# Altium schematic sheet motherboard_mcu.SchDoc
size 840 x 594 mm; SheetNumber: 1; SheetTotal: 5
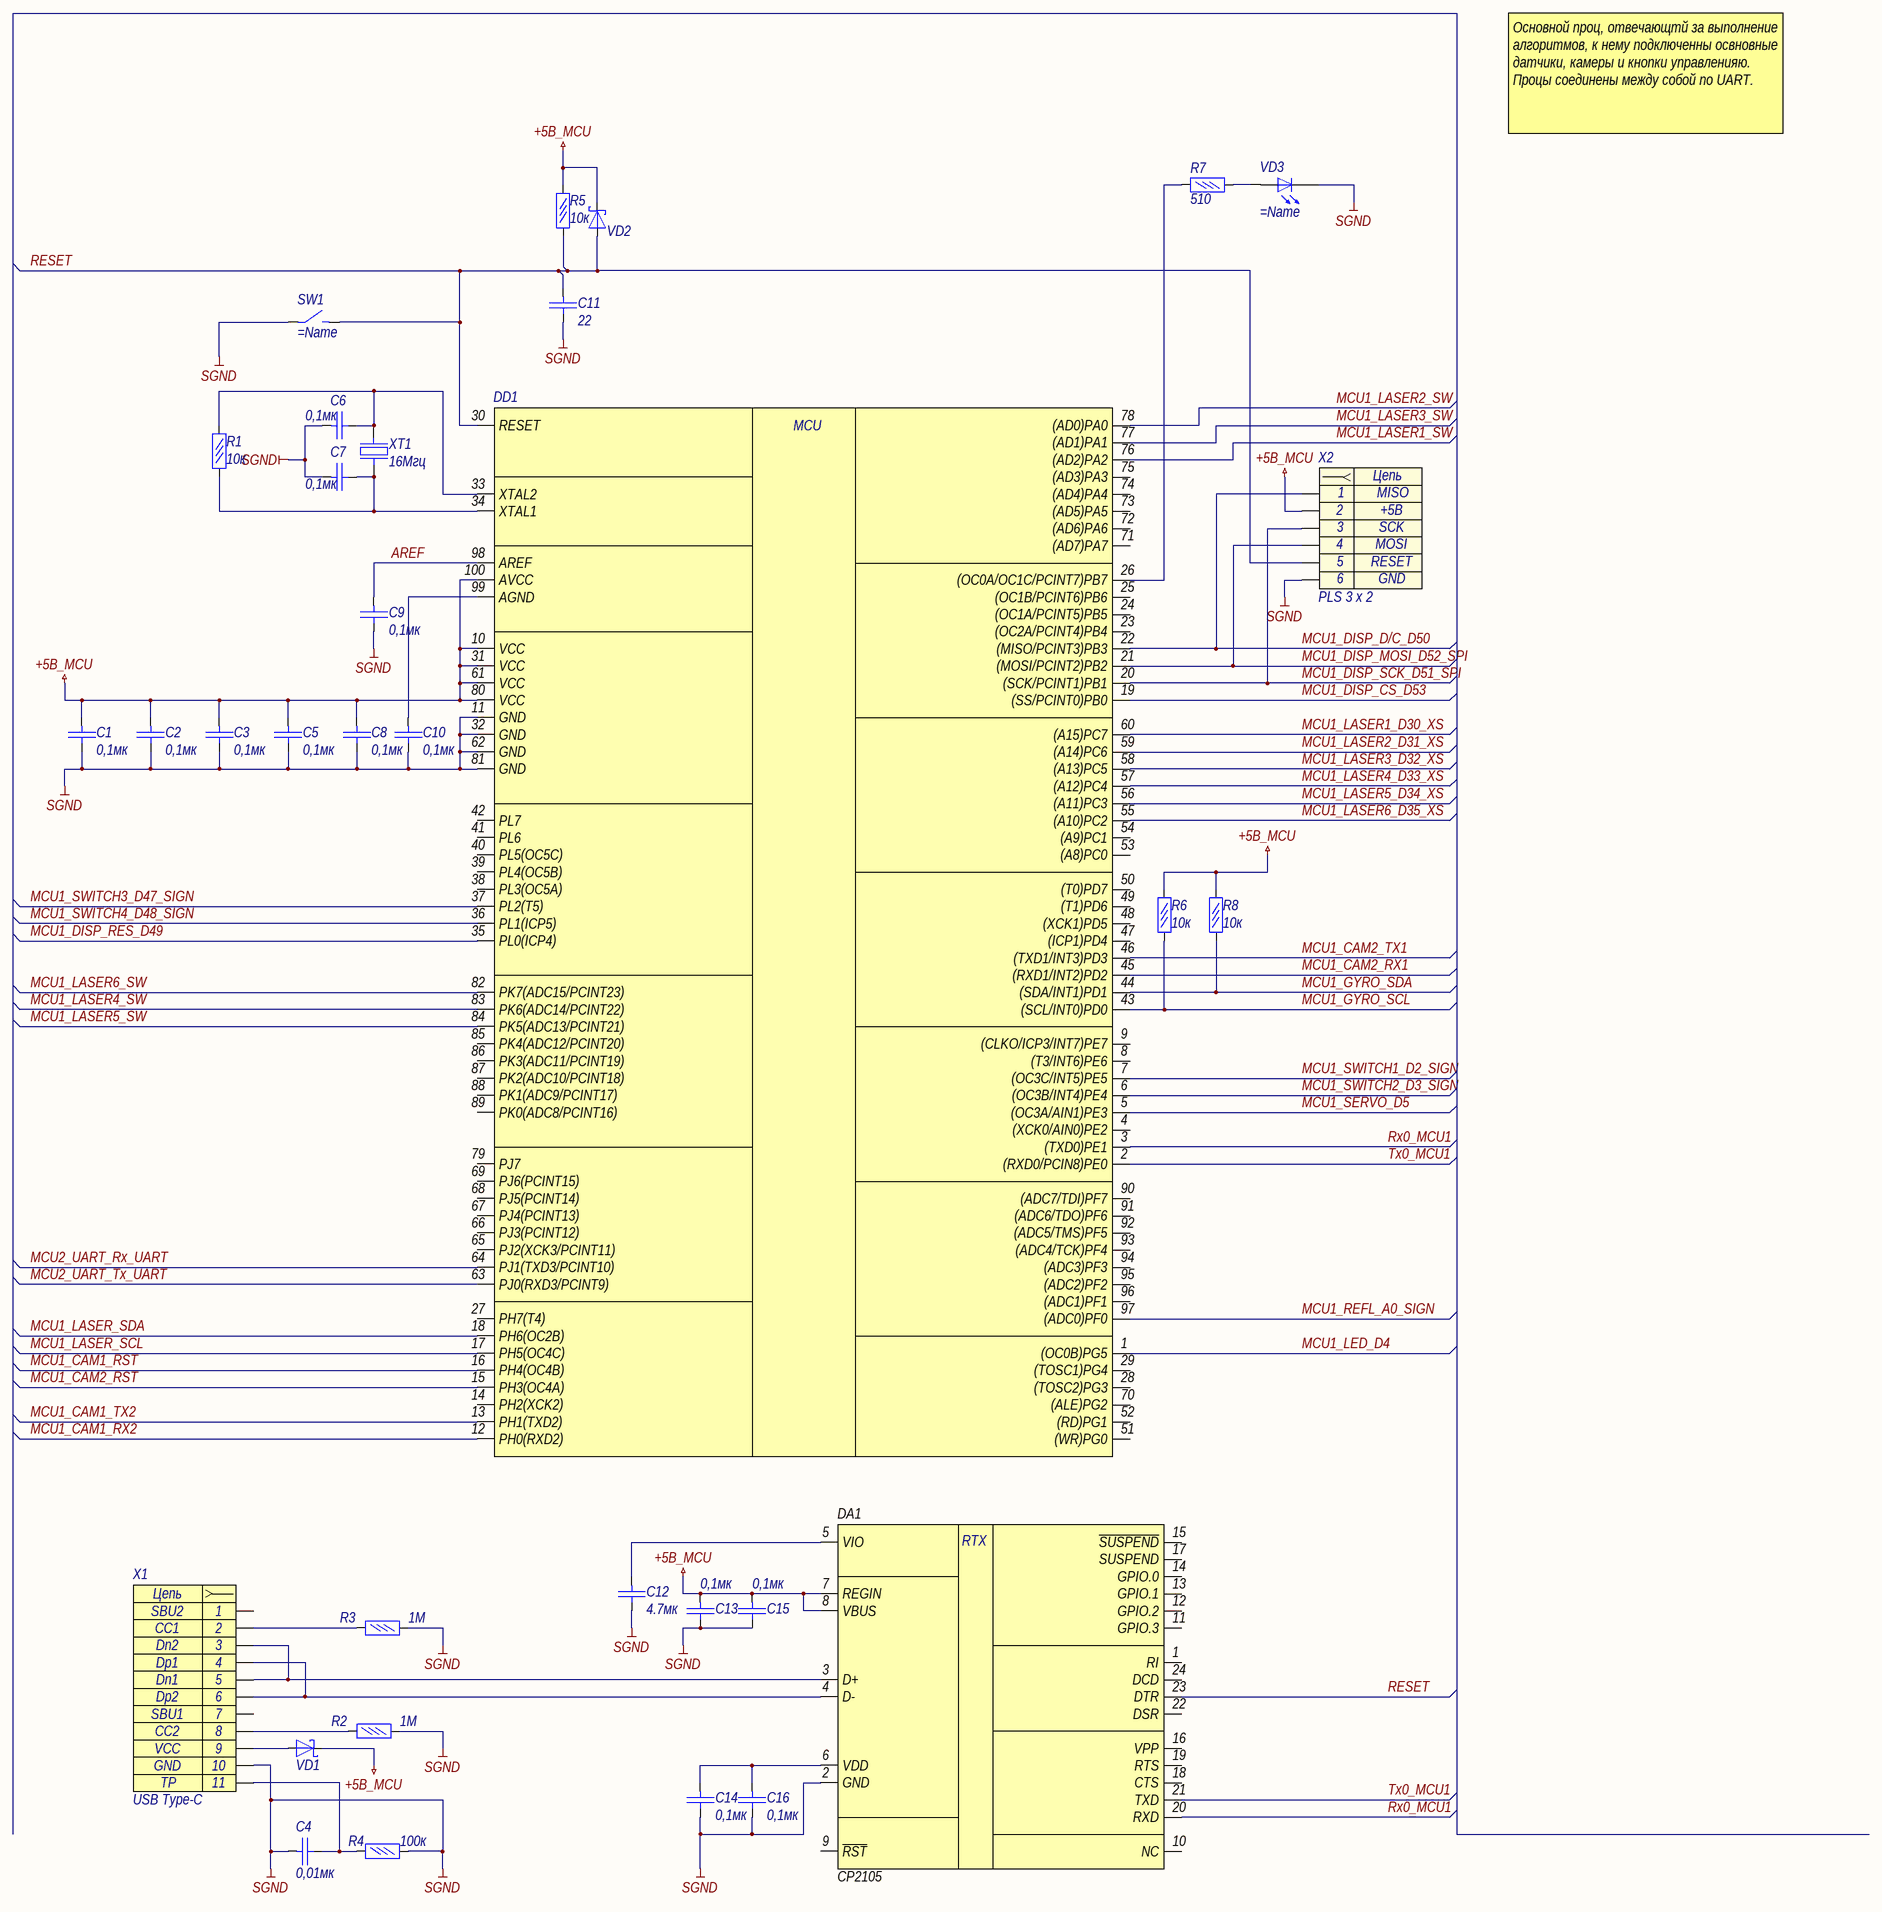
[diagram p0: motherboard_mcu.SchDoc]

## Parts
DA1  CP2105  [QFN24-PAD]
DD1  Atmega2560  [100A]  (value not drawn)
R1  10к  [R0603]
R2  1М  [R0603]
R3  1М  [R0603]
R4  100к  [R0603]
R5  10к  [R0603]
R6  10к  [R0603]
R7  510  [R0603]
R8  10к  [R0603]
SW1  (no value)  [it-1187]
VD1  (no value)  [SOD123_A]
VD2  (no value)  [SOD123_A]
VD3  (no value)  [0603 - led]
X1  USB Type-C  [USB4105-15-A-120]
X2  PLS 3 x 2  [PLS 3 x 2]
XT1  16Мгц  [KX-7]
С1  0,1мк  [C0402]
С2  0,1мк  [C0402]
С3  0,1мк  [C0402]
С4  0,01мк  [C0603]
С5  0,1мк  [C0402]
С6  0,1мк  [C0402]
С7  0,1мк  [C0402]
С8  0,1мк  [C0402]
С9  0,1мк  [C0402]
С10  0,1мк  [C0402]
С11  22  [C0603]
С12  4.7мк  [C0603]
С13  0,1мк  [C0603]
С14  0,1мк  [C0603]
С15  0,1мк  [C0603]
С16  0,1мк  [C0603]

## Nets
+5В_MCU: DA1.7(REGIN) DA1.8(VBUS) DD1.10(VCC) DD1.31(VCC) DD1.61(VCC) DD1.80(VCC) DD1.100(AVCC) R5.2 R6.1 R8.1 VD1.1(K) VD2.1(K) X2.2 С1.2 С2.2 С3.2 С5.2 С8.2 С13.2 С15.2
SGND: DA1.2(GND) DD1.11(GND) DD1.32(GND) DD1.62(GND) DD1.81(GND) R2.2 R3.2 R4.2 SW1.1 VD3.2(K) X1.10(VCC) X2.6 С1.1 С2.1 С3.1 С4.2 С5.1 С6.2 С7.2 С8.1 С9.1 С10.1 С11.1 С12.1 С13.1 С14.1 С15.1 С16.1
AREF: DD1.98(AREF) С9.2
MCU1_CAM1_RST: DD1.16(PH4(OC4B))
MCU1_CAM1_RX2: DD1.12(PH0(RXD2))
MCU1_CAM1_TX2: DD1.13(PH1(TXD2))
MCU1_CAM2_RST: DD1.15(PH3(OC4A))
MCU1_CAM2_RX1: DD1.45((RXD1/INT2)PD2)
MCU1_CAM2_TX1: DD1.46((TXD1/INT3)PD3)
MCU1_DISP_CS_D53: DD1.19((SS/PCINT0)PB0)
MCU1_DISP_D/C_D50: DD1.22((MISO/PCINT3)PB3) X2.1
MCU1_DISP_MOSI_D52_SPI: DD1.21((MOSI/PCINT2)PB2) X2.4
MCU1_DISP_RES_D49: DD1.35(PL0(ICP4))
MCU1_DISP_SCK_D51_SPI: DD1.20((SCK/PCINT1)PB1) X2.3
MCU1_GYRO_SCL: DD1.43((SCL/INT0)PD0) R6.2
MCU1_GYRO_SDA: DD1.44((SDA/INT1)PD1) R8.2
MCU1_LASER1_D30_XS: DD1.60((A15)PC7)
MCU1_LASER1_SW: DD1.76((AD2)PA2)
MCU1_LASER2_D31_XS: DD1.59((A14)PC6)
MCU1_LASER2_SW: DD1.78((AD0)PA0)
MCU1_LASER3_D32_XS: DD1.58((A13)PC5)
MCU1_LASER3_SW: DD1.77((AD1)PA1)
MCU1_LASER4_D33_XS: DD1.57((A12)PC4)
MCU1_LASER4_SW: DD1.83(PK6(ADC14/PCINT22))
MCU1_LASER5_D34_XS: DD1.56((A11)PC3)
MCU1_LASER5_SW: DD1.84(PK5(ADC13/PCINT21))
MCU1_LASER6_D35_XS: DD1.55((A10)PC2)
MCU1_LASER6_SW: DD1.82(PK7(ADC15/PCINT23))
MCU1_LASER_SCL: DD1.17(PH5(OC4C))
MCU1_LASER_SDA: DD1.18(PH6(OC2B))
MCU1_LED_D4: DD1.1((OC0B)PG5)
MCU1_REFL_A0_SIGN: DD1.97((ADC0)PF0)
MCU1_SERVO_D5: DD1.5((OC3A/AIN1)PE3)
MCU1_SWITCH1_D2_SIGN: DD1.7((OC3C/INT5)PE5)
MCU1_SWITCH2_D3_SIGN: DD1.6((OC3B/INT4)PE4)
MCU1_SWITCH3_D47_SIGN: DD1.37(PL2(T5))
MCU1_SWITCH4_D48_SIGN: DD1.36(PL1(ICP5))
MCU2_UART_Rx_UART: DD1.64(PJ1(TXD3/PCINT10))
MCU2_UART_Tx_UART: DD1.63(PJ0(RXD3/PCINT9))
RESET: DA1.23(DTR) DD1.30(RESET) R5.1 SW1.2 VD2.2(A) X2.5 С11.2
Rx0_MCU1: DA1.20(RXD) DD1.3((TXD0)PE1)
Tx0_MCU1: DA1.21(TXD) DD1.2((RXD0/PCIN8)PE0)
NetDA1_3: DA1.3(D+) X1.3(B7) X1.5(A7)
NetDA1_4: DA1.4(D-) X1.4(A6) X1.6(B6)
NetDA1_5: DA1.5(VIO) С12.2
NetDA1_6: DA1.6(VDD) С14.2 С16.2
NetDD1_26: DD1.26((OC0A/OC1C/PCINT7)PB7) R7.2
NetDD1_33: DD1.33(XTAL2) R1.2 XT1.1 С6.1
NetDD1_34: DD1.34(XTAL1) R1.1 XT1.3 С7.1
NetDD1_99: DD1.99(AGND) С10.2
NetR2_1: R2.1 X1.8(B5)
NetR3_1: R3.1 X1.2(A5)
NetR4_1: R4.1 X1.TP С4.1
NetR7_1: R7.1 VD3.1(A)
NetVD1_2: VD1.2(A) X1.9(GND)

Not connected (* = marked no-connect by the designer): DA1 1(RI) 9(~{RST}) 10(NC) 11(GPIO.3) 12(GPIO.2) 13(GPIO.1) 14(GPIO.0) 15(~{SUSPEND}) 16(VPP) 17(SUSPEND) 18(CTS) 19(RTS) 22(DSR) 24(DCD); DD1 4((XCK0/AIN0)PE2) 8((T3/INT6)PE6) 9((CLKO/ICP3/INT7)PE7) 14(PH2(XCK2)) 23((OC2A/PCINT4)PB4) 24((OC1A/PCINT5)PB5) 25((OC1B/PCINT6)PB6) 27(PH7(T4)) 28((TOSC2)PG3) 29((TOSC1)PG4) 38(PL3(OC5A)) 39(PL4(OC5B)) 40(PL5(OC5C)) 41(PL6) 42(PL7) 47((ICP1)PD4) 48((XCK1)PD5) 49((T1)PD6) 50((T0)PD7) 51((WR)PG0) 52((RD)PG1) 53((A8)PC0) 54((A9)PC1) 65(PJ2(XCK3/PCINT11)) 66(PJ3(PCINT12)) 67(PJ4(PCINT13)) 68(PJ5(PCINT14)) 69(PJ6(PCINT15)) 70((ALE)PG2) 71((AD7)PA7) 72((AD6)PA6) 73((AD5)PA5) 74((AD4)PA4) 75((AD3)PA3) 79(PJ7) 85(PK4(ADC12/PCINT20)) 86(PK3(ADC11/PCINT19)) 87(PK2(ADC10/PCINT18)) 88(PK1(ADC9/PCINT17)) 89(PK0(ADC8/PCINT16)) 90((ADC7/TDI)PF7) 91((ADC6/TDO)PF6) 92((ADC5/TMS)PF5) 93((ADC4/TCK)PF4) 94((ADC3)PF3) 95((ADC2)PF2) 96((ADC1)PF1); X1 1(B8) 7(A8)

## Notes on the sheet
- Основной проц, отвечающтй за выполнение алгоритмов, к нему подключенны освновные датчики, камеры и кнопки управленияю.
  Процы соединены между собой по UART.
- Подп. и дата
- Инв. № дубл.
- Взам. инв. №
- Инв. № подл.
- Лист
- Изм.
- № докум.
- Подп.
- Дата
- Копировал
- Формат
- А1
- (in symbol Atmega2560) MCU
- (in symbol CP2104) RTX
- (in symbol PLS 3 x 2) Цепь
- (in symbol USB4105) Цепь; 11

## Library data of the parts
DA1 = CP2104: Наименование: CP2105
R1-R8 = Резистор 0.05Вт: Резистор 0,05Вт
  R1 R5 R6 R8: Value: 10к
  R2 R3: Value: 1М
  R4: Value: 100к
  R7: Value: 510
SW1 = button
VD1 VD2 = DiodeSchottky: Диод Шоттки
VD3 = smd_led: smd led
X1 = USB4105: USB Type-C USB4105-GF-A / GCT; Contact_1: SBU2; Contact_2: CC1; Contact_3: Dn2; Contact_4: Dp1; Contact_5: Dn1; Contact_6: Dp2; Contact_7: SBU1; Contact_8: CC2; Contact_9: VCC; Contact_10: GND; Name: USB Type-C
X2 = PLS 3 x 2: Contact_1: MISO; Contact_2: +5В; Contact_3: SCK; Contact_4: MOSI; Contact_5: RESET; Contact_6: GND; Name: PLS 3 x 2
XT1 = Резонатор: 12.88605 / Geyer; Name: 12.88605; Value: 16Мгц
С1-С16 = Кер. конденсатор
  С1-С3 С5-С10 С13-С16: Value: 0,1мк
  С4: Value: 0,01мк
  С11: Value: 22
  С12: Value: 4.7мк
DD1 = Atmega2560: Name: Atmega2560